# Altium schematic sheet Main Power.SchDoc
size A; DocumentNumber: 12; SheetNumber: 12; SheetTotal: 16
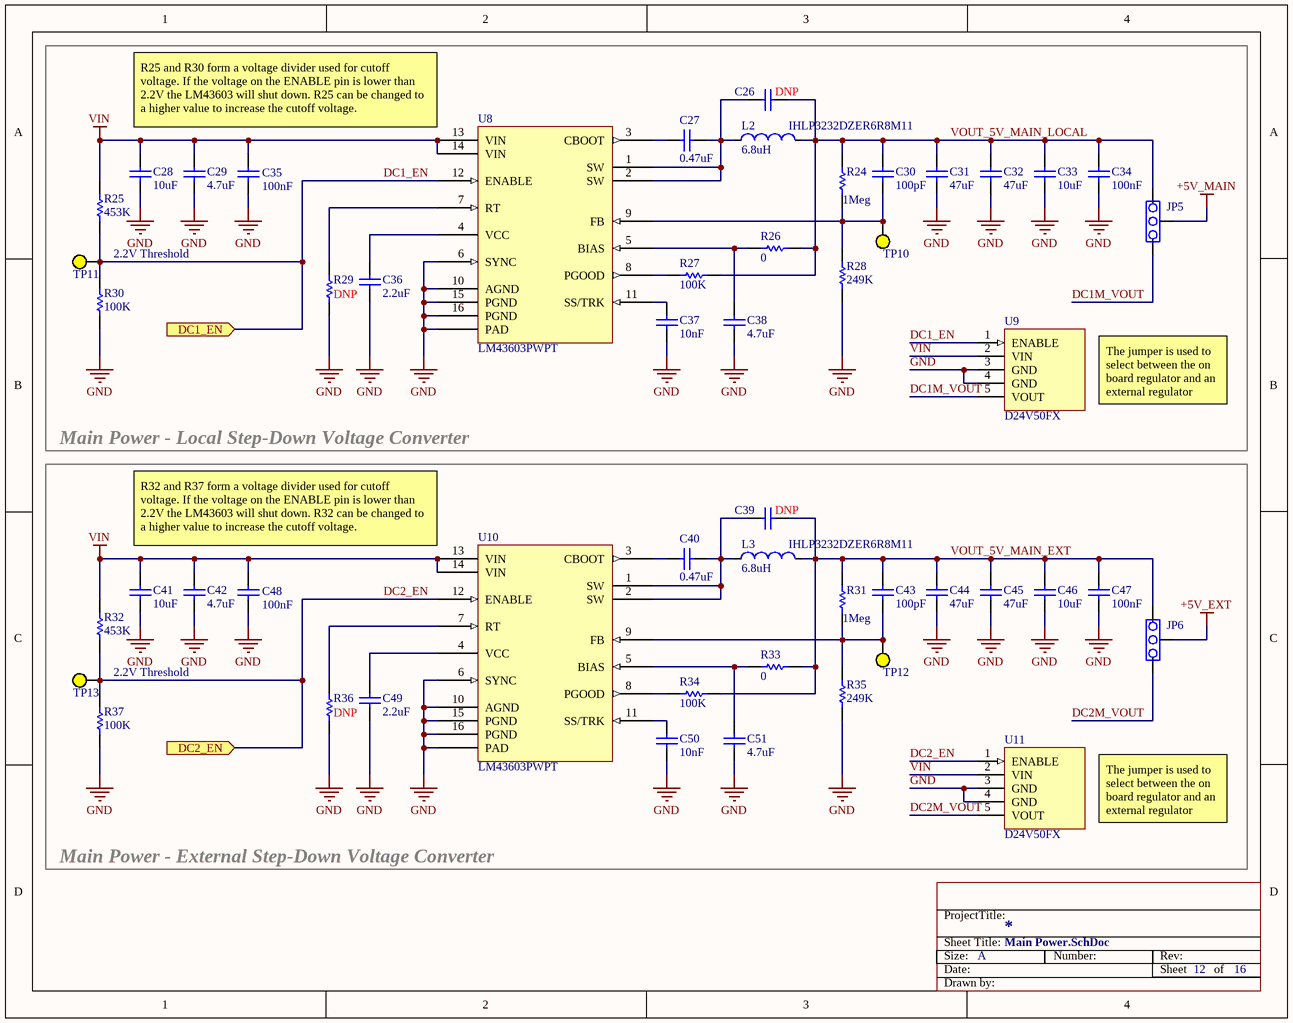
[diagram p0: Main Power.SchDoc]

## Parts
C26  Note: DNP  [CAP_0402[1005M]]  (hidden comment: Cap)
C27  value 0.47uF  [CAP_0402[1005M]]  (hidden comment: Cap)
C28  value 10uF  [CAP_1210[3225M]]  (hidden comment: Cap)
C29  value 4.7uF  [CAP_1210[3225M]]  (hidden comment: Cap)
C30  value 100pF  [CAP_0402[1005M]]  (hidden comment: Cap)
C31  value 47uF  [CAP_1210[3225M]]  (hidden comment: Cap)
C32  value 47uF  [CAP_1210[3225M]]  (hidden comment: Cap)
C33  value 10uF  [CAP_0805[2012M]]  (hidden comment: Cap)
C34  value 100nF  [CAP_0603[1608M]]  (hidden comment: Cap)
C35  value 100nF  [CAP_0402[1005M]]  (hidden comment: Cap)
C36  value 2.2uF  [CAP_0402[1005M]]  (hidden comment: CAP)
C37  value 10nF  [CAP_0402[1005M]]  (hidden comment: Cap)
C38  value 4.7uF  [CAP_0402[1005M]]  (hidden comment: Cap)
C39  Note: DNP  [CAP_0402[1005M]]  (hidden comment: Cap)
C40  value 0.47uF  [CAP_0402[1005M]]  (hidden comment: Cap)
C41  value 10uF  [CAP_1210[3225M]]  (hidden comment: Cap)
C42  value 4.7uF  [CAP_1210[3225M]]  (hidden comment: Cap)
C43  value 100pF  [CAP_0402[1005M]]  (hidden comment: Cap)
C44  value 47uF  [CAP_1210[3225M]]  (hidden comment: Cap)
C45  value 47uF  [CAP_1210[3225M]]  (hidden comment: Cap)
C46  value 10uF  [CAP_0805[2012M]]  (hidden comment: Cap)
C47  value 100nF  [CAP_0603[1608M]]  (hidden comment: Cap)
C48  value 100nF  [CAP_0402[1005M]]  (hidden comment: Cap)
C49  value 2.2uF  [CAP_0402[1005M]]  (hidden comment: CAP)
C50  value 10nF  [CAP_0402[1005M]]  (hidden comment: Cap)
C51  value 4.7uF  [CAP_0402[1005M]]  (hidden comment: Cap)
JP5  Jumper  [JUMPER_3POS]  (value not drawn)  (no BOM)
JP6  Jumper  [JUMPER_3POS]  (value not drawn)  (no BOM)
L2  6.8uH  Manufacturer Part Number: IHLP3232DZER6R8M11  [IHLP-3232DZ]
L3  6.8uH  Manufacturer Part Number: IHLP3232DZER6R8M11  [IHLP-3232DZ]
R24  value 1Meg  [RES_0402[1005M]]  (hidden comment: RES)
R25  value 453K  [RES_0603[1608M]]  (hidden comment: RES)
R26  value 0  [JUMPER_RES_0402]  (hidden comment: RES)
R27  value 100K  [RES_0402[1005M]]  (hidden comment: RES)
R28  value 249K  [RES_0402[1005M]]  (hidden comment: RES)
R29  Note: DNP  [RES_0402[1005M]]  (hidden comment: RES)
R30  value 100K  [RES_0603[1608M]]  (hidden comment: RES)
R31  value 1Meg  [RES_0402[1005M]]  (hidden comment: RES)
R32  value 453K  [RES_0603[1608M]]  (hidden comment: RES)
R33  value 0  [JUMPER_RES_0402]  (hidden comment: RES)
R34  value 100K  [RES_0402[1005M]]  (hidden comment: RES)
R35  value 249K  [RES_0402[1005M]]  (hidden comment: RES)
R36  Note: DNP  [RES_0402[1005M]]  (hidden comment: RES)
R37  value 100K  [RES_0603[1608M]]  (hidden comment: RES)
TP10  Test Point SIG  [TP_SMD_1_SILK]  (value not drawn)  (no BOM)
TP11  Test Point SIG  [TP_TH_1_SILK]  (value not drawn)  (no BOM)
TP12  Test Point SIG  [TP_SMD_1_SILK]  (value not drawn)  (no BOM)
TP13  Test Point SIG  [TP_TH_1_SILK]  (value not drawn)  (no BOM)
U8  LM43603PWPT  [HTSSOP-16]
U9  Manufacturer Part Number: D24V50FX  [D24V__F_]  (hidden comment: D24V__F_)
U10  LM43603PWPT  [HTSSOP-16]
U11  Manufacturer Part Number: D24V50FX  [D24V__F_]  (hidden comment: D24V__F_)

## Blocks framed on the sheet
Main Power - Local Step-Down Voltage Converter: C26-C38 JP5 L2 R24-R30 TP10 TP11 U8 U9
Main Power - External Step-Down Voltage Converter: C39-C51 JP6 L3 R31-R37 TP12 TP13 U10 U11

## Ports
DC1_EN (in), DC2_EN (in)

## Nets
+5V_EXT: JP6.2
+5V_MAIN: JP5.2
GND: C28.2 C29.2 C31.2 C32.2 C33.2 C34.2 C35.2 C36.1 C37.2 C38.2 C41.2 C42.2 C44.2 C45.2 C46.2 C47.2 C48.2 C49.1 C50.2 C51.2 R28.2 R29.1 R30.1 R35.2 R36.1 R37.1 U8.6(SYNC) U8.10(AGND) U8.15(PGND) U8.16(PGND) U8.EP(PAD) U9.3(GND) U9.4(GND) U10.6(SYNC) U10.10(AGND) U10.15(PGND) U10.16(PGND) U10.EP(PAD) U11.3(GND) U11.4(GND)
VIN: C28.1 C29.1 C35.1 C41.1 C42.1 C48.1 R25.2 R32.2 U8.13(VIN) U8.14(VIN) U9.2(VIN) U10.13(VIN) U10.14(VIN) U11.2(VIN)
DC1_EN: R25.1 R30.2 TP11.1 U8.12(ENABLE) U9.1(ENABLE) ; port DC1_EN
DC1M_VOUT: JP5.3 U9.5(VOUT)
DC2_EN: R32.1 R37.2 TP13.1 U10.12(ENABLE) U11.1(ENABLE) ; port DC2_EN
DC2M_VOUT: JP6.3 U11.5(VOUT)
VOUT_5V_MAIN_EXT: C39.2 C43.1 C44.1 C45.1 C46.1 C47.1 JP6.1 L3.2 R31.1 R33.1 R34.1
VOUT_5V_MAIN_LOCAL: C26.2 C30.1 C31.1 C32.1 C33.1 C34.1 JP5.1 L2.2 R24.1 R26.1 R27.1
NetC26_1: C26.1 C27.2 L2.1 U8.1(SW) U8.2(SW)
NetC27_1: C27.1 U8.3(CBOOT)
NetC30_2: C30.2 R24.2 R28.1 TP10.1 U8.9(FB)
NetC36_2: C36.2 U8.4(VCC)
NetC37_1: C37.1 U8.11(SS/TRK)
NetC38_1: C38.1 R26.2 U8.5(BIAS)
NetC39_1: C39.1 C40.2 L3.1 U10.1(SW) U10.2(SW)
NetC40_1: C40.1 U10.3(CBOOT)
NetC43_2: C43.2 R31.2 R35.1 TP12.1 U10.9(FB)
NetC49_2: C49.2 U10.4(VCC)
NetC50_1: C50.1 U10.11(SS/TRK)
NetC51_1: C51.1 R33.2 U10.5(BIAS)
NetR27_2: R27.2 U8.8(PGOOD)
NetR29_2: R29.2 U8.7(RT)
NetR34_2: R34.2 U10.8(PGOOD)
NetR36_2: R36.2 U10.7(RT)

## Notes on the sheet
- R25 and R30 form a voltage divider used for cutoff voltage. If the voltage on the ENABLE pin is lower than 2.2V the LM43603 will shut down. R25 can be changed to a higher value to increase the cutoff voltage.
- 2.2V Threshold
- The jumper is used to select between the on board regulator and an external regulator
- R32 and R37 form a voltage divider used for cutoff voltage. If the voltage on the ENABLE pin is lower than 2.2V the LM43603 will shut down. R32 can be changed to a higher value to increase the cutoff voltage.
- Sheet Title:
- ProjectTitle:
- Size:
- Date:
- A
- Number:
- Rev:
- Sheet         of
- Drawn by:

## Library data of the parts
C26 C39 = Cap: Capacitor
C27 C40 = Cap: CAP CER 0.1UF 10V 10% X7R 0402; Manufacturer Part Number: CC0402ZRY5V7BB474; Manufacturer: Yageo; Supplier 1: Digi-Key; Supplier Part Number 1: 311-1735-1-ND; ComponentLink1URL: http://www.yageo.com/documents/recent/UPY-GPHC_Y5V_6.3V-to-50V_5_revised.pdf; ComponentLink1Description: Datasheet
C28 C41 = Cap: Capacitor; Manufacturer Part Number: CL32B106KBJNNNE; Manufacturer: Samsung Electro-Mechanics America, Inc.; Supplier 1: Digi-Key; Supplier Part Number 1: 1276-3387-1-ND; ComponentLink1URL: http://www.samsungsem.com/global/support/library/product-catalog/__icsFiles/afieldfile/2014/11/13/MLCC.pdf; ComponentLink1Description: Datasheet
C29 C42 = Cap: Capacitor; Manufacturer Part Number: CL32B475KBUYNNE; Manufacturer: Samsung Electro-Mechanics America, Inc.; Supplier 1: Digi-Key; Supplier Part Number 1: 1276-1292-1-ND; ComponentLink1URL: http://media.digikey.com/pdf/Data%20Sheets/Samsung%20PDFs/CL32B475KBUYNNE_Spec.pdf; ComponentLink1Description: Datasheet
C30 C43 = Cap: CAP CER 0.1UF 10V 10% X7R 0402; Manufacturer: Yageo; Manufacturer Part Number: CC0402JRNPO9BN101; Supplier 1: Digi-Key; Supplier Part Number 1: 311-1024-1-ND; ComponentLink1URL: http://www.yageo.com/documents/recent/UPY-GP_NP0_16V-to-50V_10.pdf; ComponentLink1Description: Datasheet
C31 C32 C44 C45 = Cap: Capacitor; Manufacturer: Murata Electronics North America; Manufacturer Part Number: GRM32ER71A476KE15L; Supplier 1: Digi-Key; Supplier Part Number 1: 490-5312-1-ND; ComponentLink1URL: http://www.murata.com/~/media/webrenewal/support/library/catalog/products/capacitor/mlcc/c02e.ashx; ComponentLink1Description: Datasheet
C33 C46 = Cap: Capacitor; Manufacturer Part Number: CC0805KKX5R7BB106; Manufacturer: Yageo; Supplier 1: Digi-Key; Supplier Part Number 1: 311-1865-1-ND; ComponentLink1URL: http://www.yageo.com/documents/recent/UPY-GPHC_X5R_4V-to-50V_19.pdf; ComponentLink1Description: Datasheet
C34 C47 = Cap: Capacitor; Manufacturer Part Number: CC0603KPX7R7BB104; Manufacturer: Yageo; Supplier 1: Digi-Key; Supplier Part Number 1: 311-1335-1-ND; ComponentLink1URL: http://www.yageo.com/documents/recent/UPY-GPHC_X7R_6.3V-to-50V-v12.pdf; ComponentLink1Description: Datasheet
C35 C48 = Cap: Capacitor; Manufacturer: Yageo; Manufacturer Part Number: CC0402KRX7R6BB104; Supplier 1: Digi-Key; Supplier Part Number 1: 311-1345-1-ND; ComponentLink1URL: http://www.yageo.com/documents/recent/UPY-GPHC_X7R_6.3V-to-50V-v12.pdf; ComponentLink1Description: Datasheet
C36 C49 = CAP: Capacitor; Manufacturer: Yageo; Manufacturer Part Number: CC0402MRX5R5BB225; Supplier 1: Digi-Key; Supplier Part Number 1: 311-1442-1-ND; ComponentLink1URL: http://www.yageo.com/documents/recent/UPY-GPHC_X5R_4V-to-50V_19.pdf; ComponentLink1Description: Datasheet
C37 C50 = Cap: Capacitor; Manufacturer: Yageo; Manufacturer Part Number: CC0402KRX7R7BB103; ComponentLink1URL: http://www.yageo.com/documents/recent/UPY-GPHC_X7R_6.3V-to-50V-v12.pdf; ComponentLink1Description: Datasheet; Supplier 1: Digi-Key; Supplier Part Number 1: 311-1042-1-ND
C38 C51 = Cap: Capacitor; Manufacturer: Yageo; Manufacturer Part Number: CC0402MRX5R6BB475; Supplier 1: Digi-Key; Supplier Part Number 1: 311-1734-1-ND; ComponentLink1URL: http://www.yageo.com/documents/recent/UPY-GPHC_X5R_4V-to-50V_19.pdf; ComponentLink1Description: Datasheet
JP5 JP6 = Jumper_2
L2 L3 = Inductor: FIXED IND 6.8UH 7A 33.4 MOHM SMD; Manufacturer: Vishay Dale; Value: 6.8uH; Supplier 1: Digi-Key; ComponentLink1URL: http://www.vishay.com/docs/34313/ihlp3232dz11.pdf; ComponentLink1Description: Datasheet; Supplier Part Number 1: 541-1355-1-ND
R24 R31 = RES: Resistor; Manufacturer: Rohm Semiconductor; Manufacturer Part Number: MCR01MRTF1004; Supplier 1: Digi-Key; Supplier Part Number 1: RHM1.00MCDCT-ND; ComponentLink1URL: http://rohmfs.rohm.com/en/products/databook/datasheet/passive/resistor/chip_resistor/mcr_g.pdf; ComponentLink1Description: Datasheet
R25 R32 = RES: Resistor; Manufacturer: Yageo; Manufacturer Part Number: RC0603FR-07453KL; Supplier 1: Digi-Key; Supplier Part Number 1: 311-453KHRCT-ND; ComponentLink1URL: http://www.yageo.com/NewPortal/yageodocoutput?fileName=/pdf/R-Chip/PYu-RC_Group_51_RoHS_L_3.pdf; ComponentLink1Description: Datasheet
R26 R33 = RES: Resistor; Manufacturer Part Number: RC0402JR-070RL; Manufacturer: Yageo; Supplier 1: Digi-Key; Supplier Part Number 1: 311-0.0JRCT-ND; ComponentLink1URL: http://www.yageo.com/NewPortal/yageodocoutput?fileName=/pdf/R-Chip/PYu-RC_Group_51_RoHS_L_3.pdf; ComponentLink1Description: Datasheet
R27 R34 = RES: Resistor; Manufacturer: Yageo; Manufacturer Part Number: RC0402FR-07100KL; Supplier 1: Digi-Key; Supplier Part Number 1: 311-100KLRCT-ND; ComponentLink1URL: http://www.yageo.com/NewPortal/yageodocoutput?fileName=/pdf/R-Chip/PYu-RC_Group_51_RoHS_L_3.pdf; ComponentLink1Description: Datasheet
R28 R35 = RES: Resistor; Manufacturer: Rohm Semiconductor; Manufacturer Part Number: MCR01MRTF2493; Supplier 1: Digi-Key; Supplier Part Number 1: RHM249KCDCT-ND; ComponentLink1URL: http://rohmfs.rohm.com/en/products/databook/datasheet/passive/resistor/chip_resistor/mcr_g.pdf; ComponentLink1Description: Datasheet
R29 R36 = RES: Resistor
R30 R37 = RES: Resistor; Manufacturer: Yageo; Manufacturer Part Number: RC0603FR-07100KL; Supplier 1: Digi-Key; Supplier Part Number 1: 311-100KHRCT-ND; ComponentLink1URL: http://www.yageo.com/NewPortal/yageodocoutput?fileName=/pdf/R-Chip/PYu-RC_Group_51_RoHS_L_3.pdf; ComponentLink1Description: Datasheet
TP10-TP13 = Test Point SIG: Test Point Signal
U8 U10 = LM43603PWPT: Simple Switcher 3.5V to 36V 3A Synchronous Step-Down Voltage Converter; Manufacturer: Texas Instruments; Supplier 1: Digi-Key; Supplier Part Number 1: 296-37755-1-ND; ComponentLink1URL: http://www.ti.com/lit/ds/symlink/lm43603.pdf; ComponentLink1Description: Datasheet; Current - Output: 3A; Voltage - Input (Max): 36V; Manufacturer Part Number: LM43603PWPT; Voltage - Input (Min): 3.5V
U9 U11 = D24V__F_: Pololu Buck Converter D24V__F_ series; ComponentLink1Description: Datasheet; ComponentLink1URL: http://www.pololu.com/product/2851; Manufacturer: Pololu; Supplier 1: Pololu; Supplier Part Number 1: D24V50FX